# EAGLE design IMU (EAGLE 7.7.0)
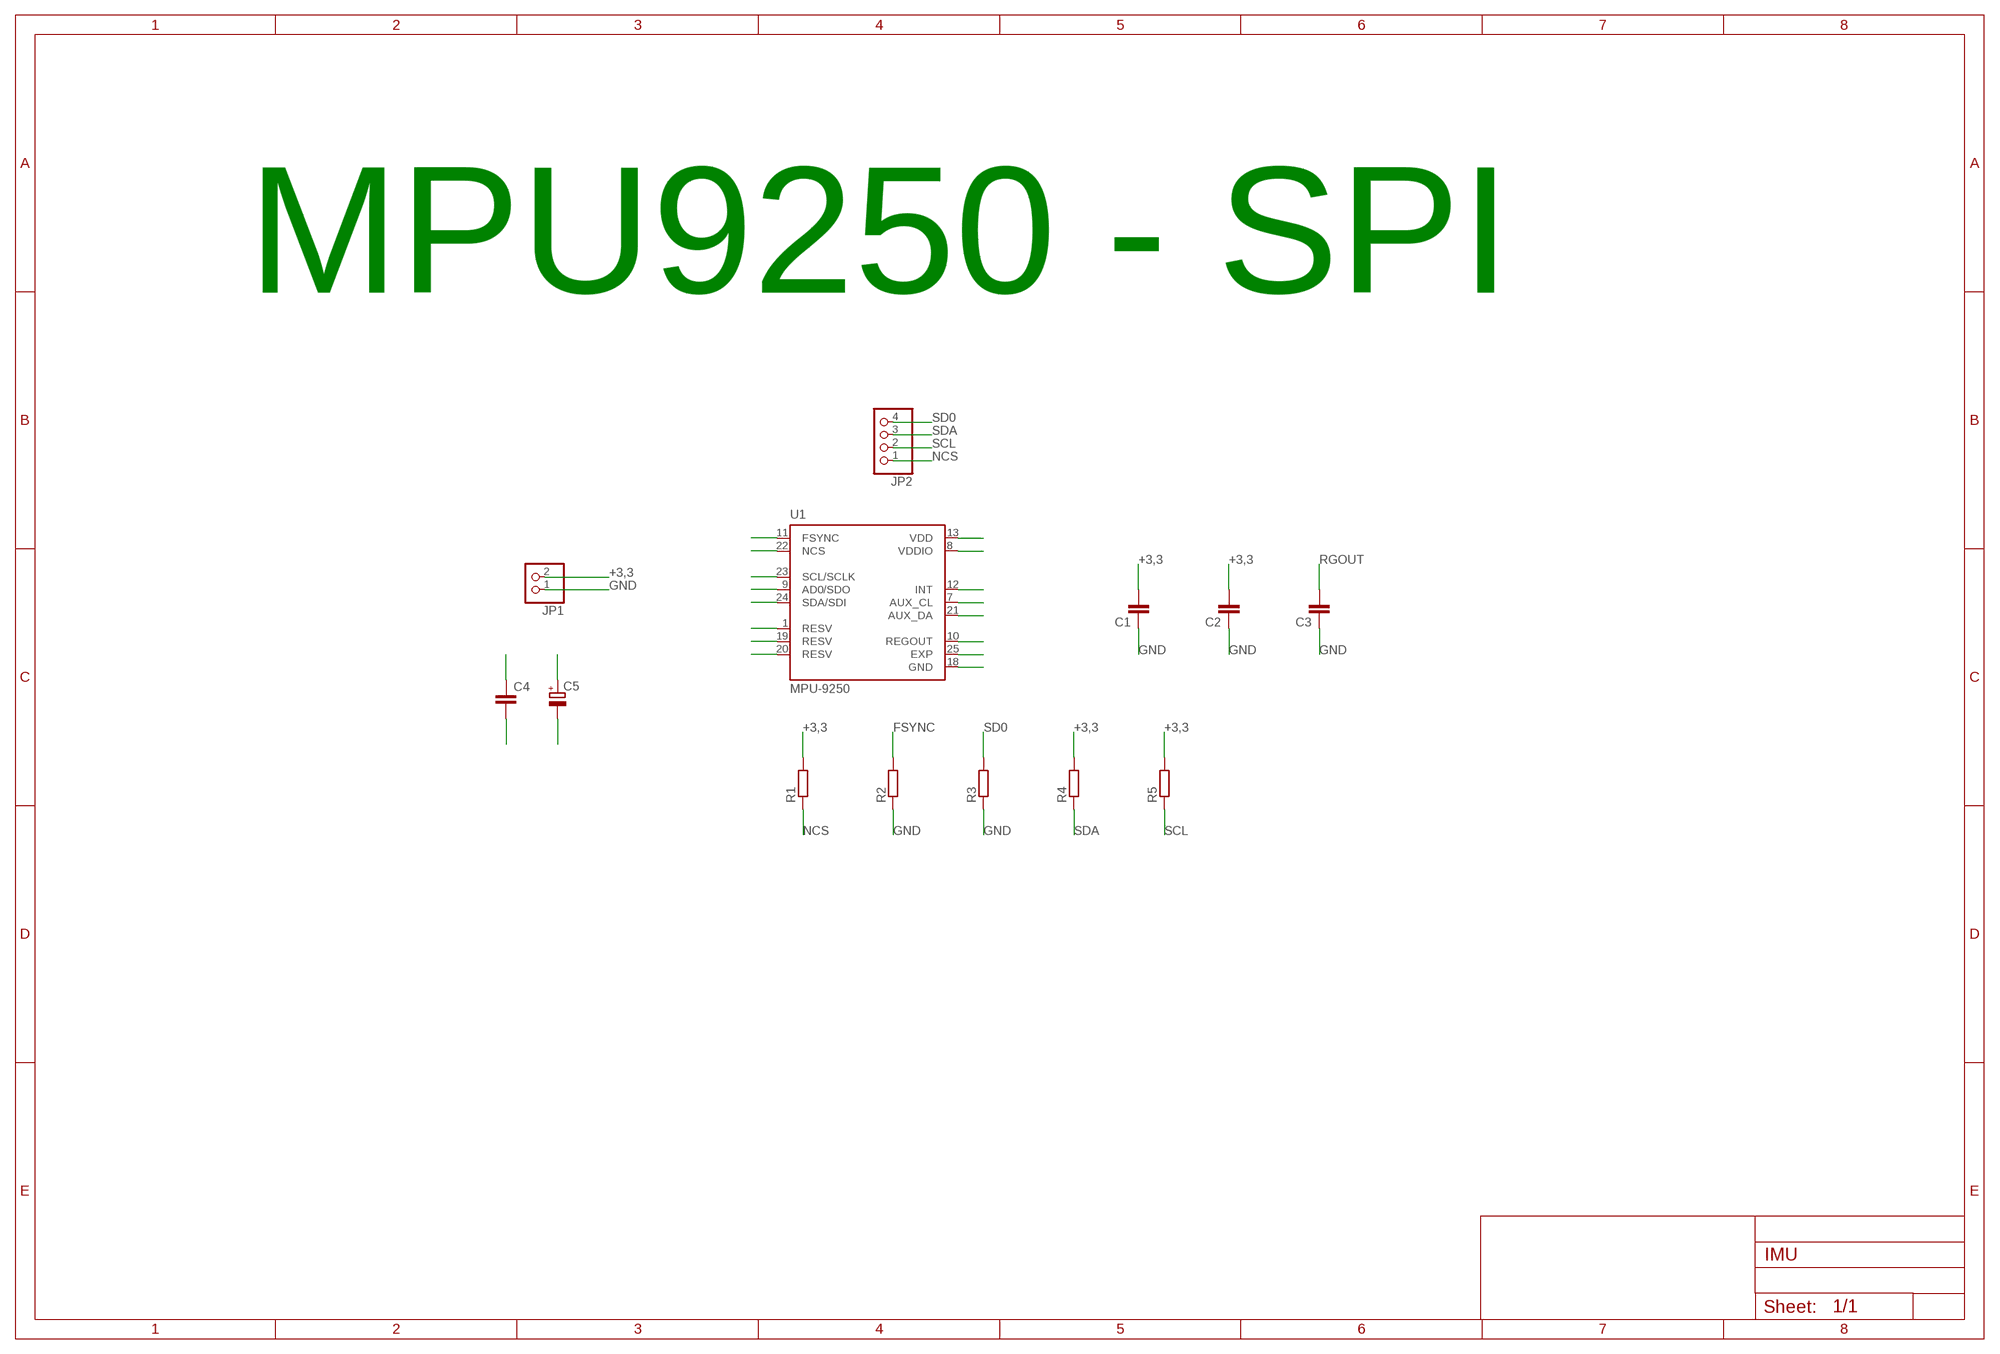
[diagram p0: schematic, sheet 1]

## Parts
C1  C-EUC0805  [C0805]
C2  C-EUC0805  [C0805]
C3  C-EUC0805  [C0805]
C4  C-EUC0805  [C0805]
C5  CPOL-EUC/6032-28R  [C/6032-28R]
JP1  PINHD-1X2  [1X02]
JP2  PINHD-1X4  [1X04]
R1  R-EU_R0805  [R0805]
R2  R-EU_R0805  [R0805]
R3  R-EU_R0805  [R0805]
R4  R-EU_R0805  [R0805]
R5  R-EU_R0805  [R0805]
U1  MPU-9250  [QFN40P300X300X105-25N]

## Nets
+3,3: C1.2 C2.2 C4.1 C5.+ JP1.2 R1.2 R4.2 R5.2 U1.1(RESV) U1.8(VDDIO) U1.13(VDD)
FSYNC: R2.2 U1.11(FSYNC)
GND: C1.1 C2.1 C3.1 C4.2 C5.- JP1.1 R2.1 R3.1 U1.18(GND) U1.20(RESV)
N$23: U1.19(RESV)
N$27: U1.12(INT)
N$28: U1.7(AUX_CL)
N$29: U1.21(AUX_DA)
N$31: U1.25(EXP)
NCS: JP2.1 R1.1 U1.22(NCS)
RGOUT: C3.2 U1.10(REGOUT)
SCL: JP2.2 R5.1 U1.23(SCL/SCLK)
SD0: JP2.4 R3.2 U1.9(AD0/SDO)
SDA: JP2.3 R4.1 U1.24(SDA/SDI)

## Notes on the sheet
- MPU9250 - SPI

## Library data of the parts
C1-C4 = rcl:C-EU: CAPACITOR, European symbol
C5 = rcl:CPOL-EU: POLARIZED CAPACITOR, European symbol
JP1 = pinhead:PINHD-1X2: PIN HEADER
JP2 = pinhead:PINHD-1X4: PIN HEADER
R1-R5 = rcl:R-EU_: RESISTOR, European symbol
U1 = MPU-9250:MPU-9250: GYRO/ACCEL/COMPASS/9-AXIS; AVAILABILITY: Good; DESCRIPTION: SMD Gyroscope/Accelerometer/Magnetometer Sensor; 9-AXIS; MF: InvenSense; MP: MPU-9250; PACKAGE: QFN-24 InvenSense; PRICE: 7.37 USD

## Board
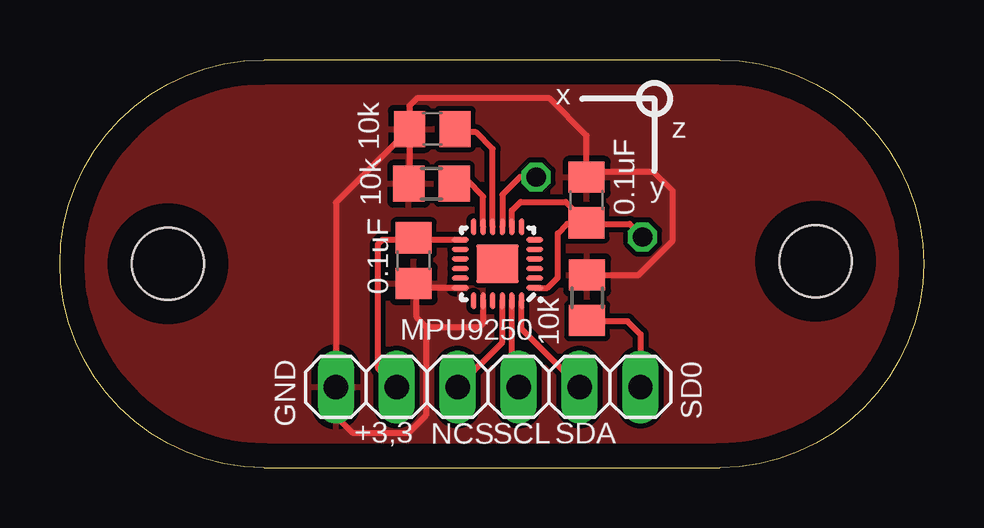
[diagram p1: board, top side]
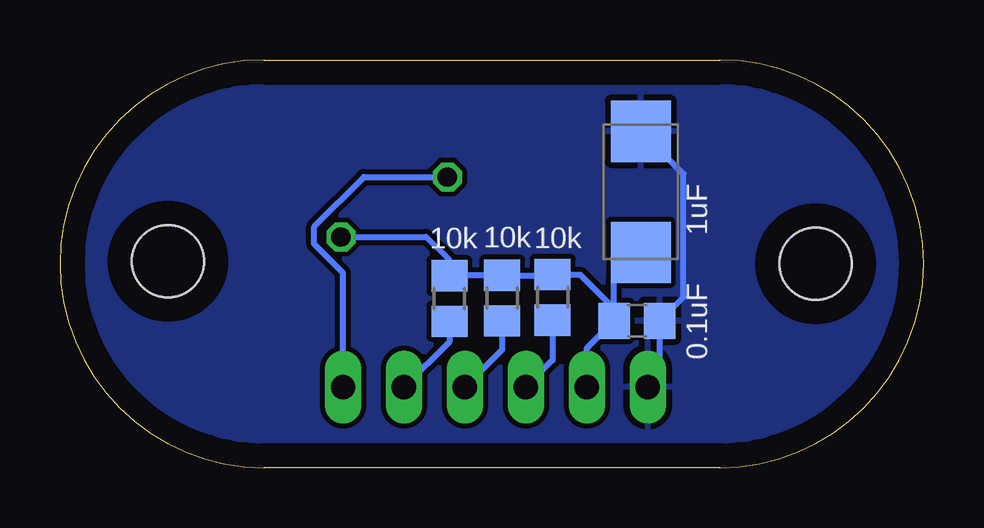
[diagram p2: board, bottom side, seen from below]

Size 36 x 17 mm. Coordinates in mm from the lower left corner, seen from the top.
Outline: 8.5,0 27.5,0 arc180 27.5,17 8.5,17 arc180 8.5,0
Copper layers (1*16): Top 0.035mm / dielectric 1.5mm / Bottom 0.035mm
Design rules "default": minimum track width 10mil, minimum drill 24mil, track to track 8mil, track to pad 8mil, pad to pad 8mil, via to via 8mil, smd to smd 8mil, copper to edge 40mil, drill to drill 8mil, minimum pad ring 10mil, minimum via ring 8mil, stop-mask expansion 4mil, vias tented up to drill 0mil, thermal gap 10mil
Holes 3 mm at 4.5,8.5 31.5,8.6

### Footprints (pad centres in the part's own frame; a part is rotated, then mirrored left to right if it is on the bottom)
C0805 = smd 1.3 x 1.5: 1 -0.95,0; 2 0.95,0
C/6032-28R = smd 2.55 x 2.5: + 2.525,0; - -2.525,0
1X02 = drill 1.016 long: 1 -1.27,0; 2 1.27,0
1X04 = drill 1.016 long: 1 -3.81,0; 2 -1.27,0; 3 1.27,0; 4 3.81,0
R0805 = smd 1.3 x 1.5: 1 -0.95,0; 2 0.95,0
QFN40P300X300X105-25N = smd 0.7 x 0.2: 1 -1.55,1; 2 -1.55,0.6; 3 -1.55,0.2; 4 -1.55,-0.2; 5 -1.55,-0.6; 6 -1.55,-1; 13 1.55,-1; 14 1.55,-0.6; 15 1.55,-0.2; 16 1.55,0.2; 17 1.55,0.6; 18 1.55,1 | smd 0.2 x 0.7: 7 -1,-1.55; 8 -0.6,-1.55; 9 -0.2,-1.55; 10 0.2,-1.55; 11 0.6,-1.55; 12 1,-1.55; 19 1,1.55; 20 0.6,1.55; 21 0.2,1.55; 22 -0.2,1.55; 23 -0.6,1.55; 24 -1,1.55 | smd 1.75 x 1.6: 25 0,0

### Placement (x,y rotation side)
C1  21.95,11.16 270 top
C2  14.74,8.63 90 top
C3  15.52,14.12 0 top
C4  11.95,6.12 0 bottom
C5  11.79,11.5 270 bottom
JP1  12.77,3.36 0 top
JP2  20.39,3.36 0 top
R1  15.46,7.1 90 bottom
R2  15.49,11.84 0 top
R3  21.97,7.08 270 top
R4  19.77,7.05 90 bottom
R5  17.57,7.07 90 bottom
U1  18.24,8.5 180 top

### Tracks (layer width: path | path; a pad name or v marks a point on that pad's centre or on a via)
+3,3  (via drill 0.8)
  Top 0.254: U1.13 14.82,9.5 | 14.82,9.5 C2.2 | U1.1 20.32,7.5 20.75,7.93 20.75,9.77 21.14,10.16 21.9,10.16 | 14.82,9.5 13.43,9.5 13.24,9.31 13.24,4.16 JP1.2 | U1.8 18.84,10.72 19.2,11.08 21.08,11.08 C1.2 21.9,10.16 | 21.9,10.16 23.75,10.16 v24.29,9.62
  Bottom 0.254: JP1.2 14.04,4.98 C4.1 12.9,6.63 | 12.9,6.63 12.9,7.87 C5.+ | 12.9,6.63 14.32,8.05 R1.2 15.49,8.02 R5.2 19.75,8.02 R4.2 19.77,8.65 20.74,9.62 v24.29,9.62
FSYNC
  Top 0.254: U1.11 17.64,11.3 16.96,11.98 16.58,11.98 R2.2
GND
  Top 0.254: C3.1 14.57,11.87 R2.1 | C3.1 14.57,15.09 14.88,15.4 20.4,15.4 21.95,13.85 C1.1 22.17,12.33 24.77,12.33 25.55,11.55 25.55,9.47 24.11,8.03 R3.1 | U1.18 14.92,7.5 C2.1 14.87,7.55 14.87,6.26 15.26,5.87 | U1.20 17.64,6.02 17.46,5.84 15.29,5.84 15.26,5.87 | 15.26,5.87 15.26,2.18 14.53,1.45 12.19,1.45 11.5,2.14 JP1.1 11.5,11.05 C3.1
  Bottom 0.254: JP1.1 11,3.86 C4.2 10.01,7.11 10.01,12.24 C5.-
  pour Top: 8.5,0 arc-90 0.02,8.48 0.02,8.88 0.02,8.97 arc-90 7.97,16.92 27.94,16.92 arc-90 36.02,8.84 36.02,8.43 arc-90 27.59,0
  pour Bottom: 8.5,0 8.46,0 arc-90 0,8.46 0,8.97 arc-90 8,16.97 27.59,16.97 arc-90 36.02,8.54 36.02,8.42 arc-90 27.6,0
NCS
  Top 0.254: JP2.1 18.44,5.22 U1.22
  Bottom 0.254: R1.1 15.46,4.48 JP2.1
RGOUT
  Top 0.254: U1.10 18.04,13.29 17.35,13.98 16.61,13.98 C3.2
SCL
  Top 0.254: JP2.2 18.84,3.64 U1.23
  Bottom 0.254: R5.1 17.57,4.91 JP2.2
SD0  (via drill 0.8)
  Top 0.254: v19.85,12.12 19.18,12.12 18.44,11.38 U1.9 | R3.2 22,6.1 23.66,6.1 24.2,5.56 JP2.4
  Bottom 0.254: JP2.4 24.2,8.12 25.4,9.32 25.4,10.05 23.33,12.12 v19.85,12.12
SDA
  Top 0.254: JP2.3 19.24,5.78 U1.24
  Bottom 0.254: R4.1 19.77,5.25 JP2.3

### Text on the board
tPlace: x | z | 0.1uF | 10k | y | 10k | 0.1uF | MPU9250 | 10k | GND | SD0 | +3,3 | NCS | SCL | SDA
bPlace: 1uF | 10k | 10k | 10k | 0.1uF